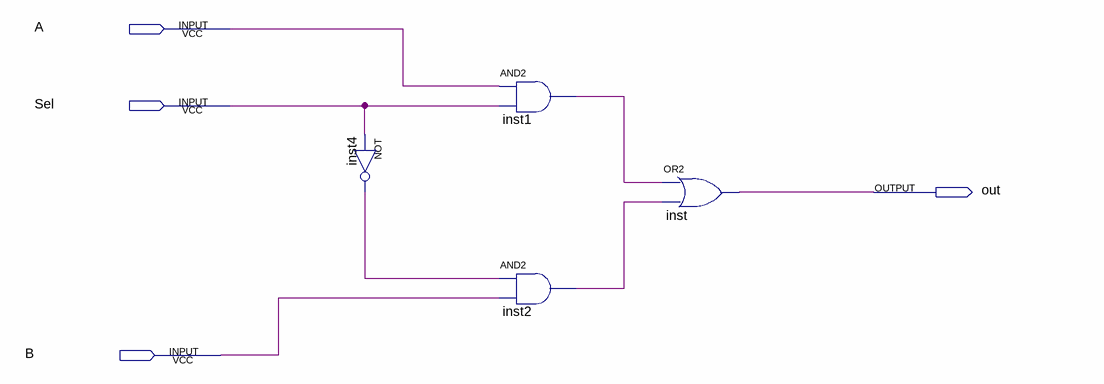
[diagram p0: schematic sheet]
// Quartus schematic name_top.bdf as structural Verilog: 4 symbols, 4 pins
module name_top (
  input  A,
  input  Sel,
  input  B,
  output out
);

  wire inst1_out, inst2_out, inst4_out;

  not inst4 (inst4_out, Sel);
  and inst1 (inst1_out, A, Sel);
  and inst2 (inst2_out, inst4_out, B);
  or inst (out, inst1_out, inst2_out);
endmodule
